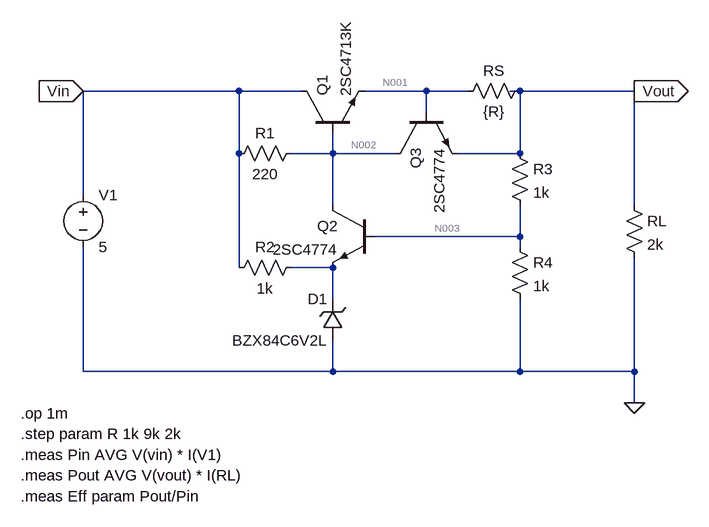
[diagram p0: schematic Draft2.asc]
Draft2.asc, the LTspice schematic file:
Version 4
SHEET 1 880 680
WIRE -112 -48 -352 -48
WIRE -16 -48 -112 -48
WIRE 176 -48 80 -48
WIRE 240 -48 176 -48
WIRE 320 -48 304 -48
WIRE 496 -48 320 -48
WIRE 176 -16 176 -48
WIRE -112 48 -112 -48
WIRE 32 48 32 16
WIRE 32 48 -32 48
WIRE 128 48 32 48
WIRE 320 48 320 -48
WIRE 320 48 224 48
WIRE -352 112 -352 -48
WIRE 32 128 32 48
WIRE 496 128 496 -48
WIRE 320 176 320 128
WIRE 320 176 96 176
WIRE 320 192 320 176
WIRE -112 224 -112 48
WIRE 32 224 -32 224
WIRE 32 272 32 224
WIRE -352 384 -352 192
WIRE 32 384 32 336
WIRE 32 384 -352 384
WIRE 320 384 320 272
WIRE 320 384 32 384
WIRE 496 384 496 208
WIRE 496 384 320 384
WIRE 496 432 496 384
FLAG 496 432 0
FLAG -352 -48 Vin
IOPIN -352 -48 In
FLAG 496 -48 Vout
IOPIN 496 -48 Out
SYMBOL res -16 32 R90
WINDOW 0 0 56 VBottom 2
WINDOW 3 32 56 VTop 2
SYMATTR InstName R1
SYMATTR Value 220
SYMBOL res -16 208 R90
WINDOW 0 0 56 VBottom 2
WINDOW 3 32 56 VTop 2
SYMATTR InstName R2
SYMATTR Value 1k
SYMBOL res 304 32 R0
SYMATTR InstName R3
SYMATTR Value 1k
SYMBOL res 304 176 R0
SYMATTR InstName R4
SYMATTR Value 1k
SYMBOL res 480 112 R0
SYMATTR InstName RL
SYMATTR Value 2k
SYMBOL res 336 -64 R90
WINDOW 0 0 56 VBottom 2
WINDOW 3 32 56 VTop 2
SYMATTR InstName RS
SYMATTR Value {R}
SYMBOL npn -16 16 R270
SYMATTR InstName Q1
SYMATTR Value 2SC4713K
SYMBOL npn 96 128 M0
SYMATTR InstName Q2
SYMATTR Value 2SC4774
SYMBOL npn 128 -16 M90
SYMATTR InstName Q3
SYMATTR Value 2SC4774
SYMBOL zener 48 336 R180
WINDOW 0 24 64 Left 2
WINDOW 3 24 0 Left 2
SYMATTR InstName D1
SYMATTR Value BZX84C6V2L
SYMBOL voltage -352 96 R0
WINDOW 123 0 0 Left 0
WINDOW 39 0 0 Left 0
SYMATTR InstName V1
SYMATTR Value 5
TEXT -448 448 Left 2 !.op 1m
TEXT -448 480 Left 2 !.step param R 1k 9k 2k
TEXT -448 512 Left 2 !.meas Pin AVG V(vin) * I(V1)
TEXT -448 544 Left 2 !.meas Pout AVG V(vout) * I(RL)
TEXT -448 576 Left 2 !.meas Eff param Pout/Pin

The netlist it stands for:
* Draft2.asc
R1 N002 Vin 220
R2 N004 Vin 1k
R3 Vout N003 1k
R4 N003 0 1k
RL Vout 0 2k
RS Vout N001 {R}
Q1 Vin N002 N001 0 2SC4713K
Q2 N002 N003 N004 0 2SC4774
Q3 N002 N001 Vout 0 2SC4774
D1 0 N004 BZX84C6V2L
V1 Vin 0 5
.model D D
.lib standard.dio
.model NPN NPN
.model PNP PNP
.lib standard.bjt
.op 1m
.step param R 1k 9k 2k
.meas Pin AVG V(vin) * I(V1)
.meas Pout AVG V(vout) * I(RL)
.meas Eff param Pout/Pin
.backanno
.end

* Results of the author's LTspice run, read from the files saved beside the schematic
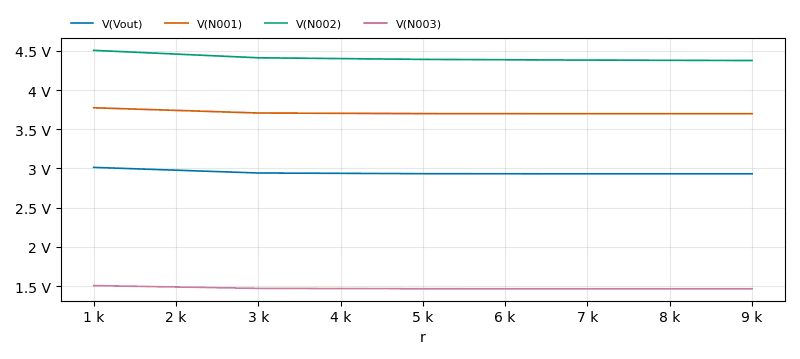
[diagram p1: Operating Point of Draft2.asc, plotted from the saved traces]
* Operating Point, 1 run:
*   V(Vout): 3.014 V at r=1 k, 2.932 V at r=9 k, min 2.932 V, max 3.014 V
*   V(N001): 3.774 V at r=1 k, 3.698 V at r=9 k, min 3.698 V, max 3.774 V
*   V(N002): 4.505 V at r=1 k, 4.376 V at r=9 k, min 4.376 V, max 4.505 V
*   V(N003): 1.507 V at r=1 k, 1.466 V at r=9 k, min 1.466 V, max 1.507 V
* From the log:
*   Semiconductor Device Operating Points:
*                           --- Diodes ---
*   Name:      d1
*   Model: bzx84c6v2l
*   Id:     -1.70e-09
*   Vd:     -5.00e+00
*   Req:     4.04e+08
*   CAP:     7.55e-11
*                           --- Bipolar Transistors ---
*   Name:       q1          q2          q3
*   Model:   2sc4713k     2sc4774     2sc4774
*   Ib:       2.88e-06   -6.60e-12    8.46e-06
*   Ic:       7.66e-04    3.11e-12    2.25e-03
*   Vbe:      7.32e-01   -3.49e+00    7.60e-01
*   Vbc:     -4.95e-01   -3.00e+00   -7.32e-01
*   Vce:      1.23e+00   -4.95e-01    1.49e+00
*   BetaDC:   2.66e+02   -4.71e-01    2.65e+02
*   Gm:       2.94e-02   -7.54e-65    8.50e-02
*   Rpi:      9.06e+03    1.00e+12    3.07e+03
*   Rx:       3.05e+01    3.05e+01    3.05e+01
*   Ro:       7.64e+04    1.33e+64    2.61e+04
*   Cbe:      9.01e-12    1.61e-12    1.94e-11
*   Cbc:      1.24e-12    1.11e-12    1.22e-12
*   Cjs:      0.00e+00    0.00e+00    0.00e+00
*   BetaAC:   2.66e+02   -7.54e-53    2.61e+02
*   Cbx:      0.00e+00    0.00e+00    0.00e+00
*   Ft:       4.56e+08    5.84e-02    6.57e+08
*   pin: AVG(v(vin))=5 FROM 1000 TO 9000
*   pout: AVG(v(vout))=2.94508 FROM 1000 TO 9000
*   eff: pout/pin=0.589016